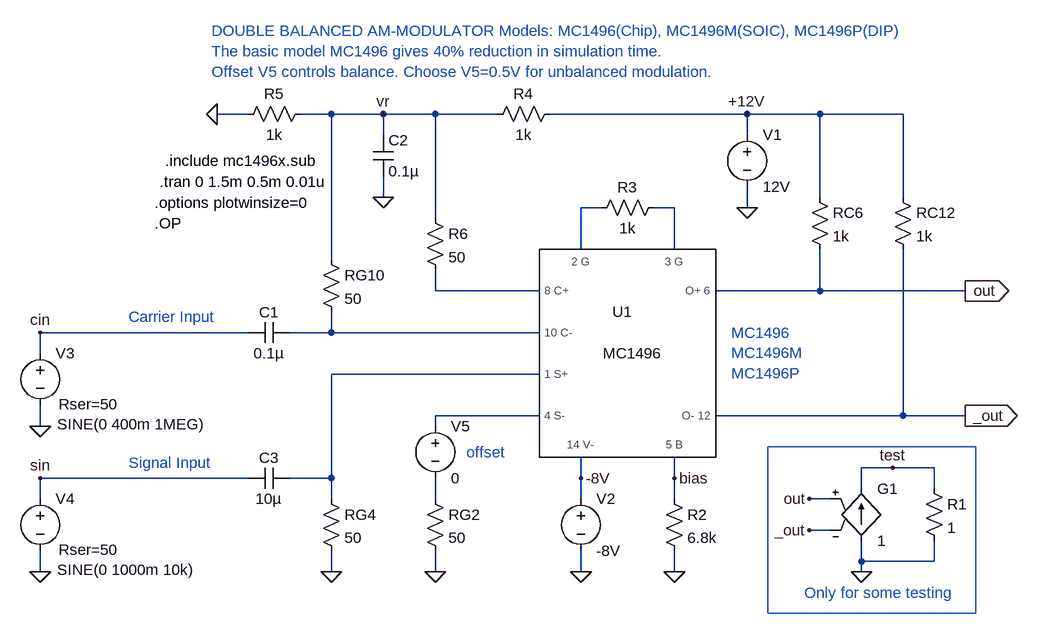
[diagram p0: schematic MC1496Test.asc]
MC1496Test.asc, the LTspice schematic file:
Version 4
SHEET 1 1672 1236
WIRE -1184 128 -1184 96
WIRE -1184 240 -1184 208
WIRE -1184 352 -1184 320
WIRE -1184 464 -1184 432
WIRE -864 -240 -912 -240
WIRE -864 96 -1184 96
WIRE -864 320 -1184 320
WIRE -736 -240 -784 -240
WIRE -736 -16 -736 -240
WIRE -736 96 -800 96
WIRE -736 96 -736 64
WIRE -736 320 -800 320
WIRE -736 320 -736 160
WIRE -736 352 -736 320
WIRE -736 464 -736 432
WIRE -656 -240 -736 -240
WIRE -656 -208 -656 -240
WIRE -656 -112 -656 -144
WIRE -576 -240 -656 -240
WIRE -576 -80 -576 -240
WIRE -576 32 -576 0
WIRE -576 240 -576 224
WIRE -576 352 -576 320
WIRE -576 464 -576 432
WIRE -480 -240 -576 -240
WIRE -416 32 -576 32
WIRE -416 96 -736 96
WIRE -416 160 -736 160
WIRE -416 224 -576 224
WIRE -352 -32 -352 -96
WIRE -352 320 -352 288
WIRE -352 352 -352 320
WIRE -352 464 -352 432
WIRE -320 -96 -352 -96
WIRE -208 -96 -240 -96
WIRE -208 -32 -208 -96
WIRE -208 320 -208 288
WIRE -208 352 -208 320
WIRE -208 464 -208 432
WIRE -96 -240 -400 -240
WIRE -96 -208 -96 -240
WIRE -96 -96 -96 -128
WIRE 16 -240 -96 -240
WIRE 16 -112 16 -240
WIRE 16 32 -144 32
WIRE 16 32 16 -32
WIRE 32 352 0 352
WIRE 32 400 0 400
WIRE 80 336 80 304
WIRE 80 448 80 416
WIRE 80 464 80 448
WIRE 128 304 80 304
WIRE 144 -240 16 -240
WIRE 144 -112 144 -240
WIRE 144 224 -144 224
WIRE 144 224 144 -32
WIRE 192 304 128 304
WIRE 192 336 192 304
WIRE 192 448 80 448
WIRE 192 448 192 416
WIRE 240 32 16 32
WIRE 240 224 144 224
FLAG -96 -96 0
FLAG -352 464 0
FLAG -352 320 -8V
FLAG -96 -240 +12V
FLAG -736 464 0
FLAG -1184 464 0
FLAG -656 -240 vr
FLAG -1184 240 0
FLAG 80 464 0
FLAG 128 304 test
FLAG 0 400 _out
FLAG 0 352 out
FLAG -208 464 0
FLAG -576 464 0
FLAG -912 -240 0
FLAG -656 -112 0
FLAG 240 32 out
IOPIN 240 32 Out
FLAG 240 224 _out
IOPIN 240 224 Out
FLAG -208 320 bias
FLAG -1184 96 cin
FLAG -1184 320 sin
SYMBOL voltage -96 -224 R0
WINDOW 123 0 0 Left 0
WINDOW 39 0 0 Left 0
SYMATTR InstName V1
SYMATTR Value 12V
SYMBOL voltage -352 336 R0
SYMATTR InstName V2
SYMATTR Value -8V
SYMBOL res -752 336 R0
SYMATTR InstName RG4
SYMATTR Value 50
SYMBOL res 0 -128 R0
SYMATTR InstName RC6
SYMATTR Value 1k
SYMBOL res 128 -128 R0
SYMATTR InstName RC12
SYMATTR Value 1k
SYMBOL res -752 -32 R0
SYMATTR InstName RG10
SYMATTR Value 50
SYMBOL res 176 320 R0
SYMATTR InstName R1
SYMATTR Value 1
SYMBOL g 80 320 R0
SYMATTR InstName G1
SYMATTR Value 1
SYMBOL res -224 336 R0
SYMATTR InstName R2
SYMATTR Value 6.8k
SYMBOL res -336 -80 R270
WINDOW 0 32 56 VTop 0
WINDOW 3 0 56 VBottom 0
SYMATTR InstName R3
SYMATTR Value 1k
SYMBOL res -592 336 R0
SYMATTR InstName RG2
SYMATTR Value 50
SYMBOL voltage -1184 112 R0
WINDOW 3 26 125 Left 0
WINDOW 123 0 0 Left 0
WINDOW 39 28 94 Left 0
SYMATTR Value SINE(0 400m 1MEG)
SYMATTR SpiceLine Rser=50
SYMATTR InstName V3
SYMBOL res -496 -224 R270
WINDOW 0 32 56 VTop 0
WINDOW 3 0 56 VBottom 0
SYMATTR InstName R4
SYMATTR Value 1k
SYMBOL res -880 -224 R270
WINDOW 0 32 56 VTop 0
WINDOW 3 0 56 VBottom 0
SYMATTR InstName R5
SYMATTR Value 1k
SYMBOL res -592 -96 R0
SYMATTR InstName R6
SYMATTR Value 50
SYMBOL cap -864 112 R270
WINDOW 0 32 32 VTop 0
WINDOW 3 0 32 VBottom 0
SYMATTR InstName C1
SYMATTR Value 0.1µ
SYMBOL cap -672 -208 R0
SYMATTR InstName C2
SYMATTR Value 0.1µ
SYMBOL voltage -1184 336 R0
WINDOW 3 26 125 Left 0
WINDOW 123 0 0 Left 0
WINDOW 39 28 94 Left 0
SYMATTR Value SINE(0 1000m 10k)
SYMATTR SpiceLine Rser=50
SYMATTR InstName V4
SYMBOL cap -864 336 R270
WINDOW 0 32 32 VTop 0
WINDOW 3 0 32 VBottom 0
SYMATTR InstName C3
SYMATTR Value 10µ
SYMBOL voltage -576 224 R0
SYMATTR InstName V5
SYMATTR Value 0
SYMBOL mc1496 -272 128 R0
SYMATTR InstName U1
TEXT -1048 72 Left 0 ;Carrier Input
TEXT -1048 296 Left 0 ;Signal Input
TEXT -1000 -136 Left 0 !.tran 0 1.5m 0.5m 0.01u
TEXT -920 -368 Left 0 ;DOUBLE BALANCED AM-MODULATOR Models: MC1496(Chip), MC1496M(SOIC), MC1496P(DIP)\nThe basic model MC1496 gives 40% reduction in simulation time.\nOffset V5 controls balance. Choose V5=0.5V for unbalanced modulation.
TEXT -1008 -72 Left 0 !.OP
TEXT -1008 -104 Left 0 !.options plotwinsize=0
TEXT -992 -168 Left 0 !.include mc1496x.sub
TEXT -528 280 Left 0 ;offset
TEXT -120 96 Left 0 ;MC1496\nMC1496M\nMC1496P
TEXT -8 496 Left 0 ;Only for some testing
RECTANGLE Normal 256 528 -64 272

The netlist it stands for:
* MC1496Test.asc
V1 +12V 0 12V
V2 -8V 0 -8V
RG4 N002 0 50
RC6 +12V out 1k
RC12 +12V _out 1k
RG10 vr N001 50
R1 test 0 1
G1 0 test out _out 1
R2 bias 0 6.8k
R3 N006 N007 1k
RG2 N005 0 50
V3 cin 0 SINE(0 400m 1MEG) Rser=50
R4 vr +12V 1k
R5 0 vr 1k
R6 vr N003 50
C1 cin N001 0.1µ
C2 vr 0 0.1µ
V4 sin 0 SINE(0 1000m 10k) Rser=50
C3 sin N002 10µ
V5 N004 N005 0
XU1 N003 N001 N002 N004 N006 N007 -8V bias out _out MC1496  ; pins 8_C+ 10_C- 1_S+ 4_S- 2_G 3_G 14_V- 5_B O+_6 O-_12
* Carrier Input
* Signal Input
.tran 0 1.5m 0.5m 0.01u
* DOUBLE BALANCED AM-MODULATOR Models: MC1496(Chip), MC1496M(SOIC), MC1496P(DIP)
* The basic model MC1496 gives 40% reduction in simulation time.
* Offset V5 controls balance. Choose V5=0.5V for unbalanced modulation.
.OP
.options plotwinsize=0
.include mc1496x.sub
* offset
* MC1496
* MC1496M
* MC1496P
* Only for some testing
.backanno
.end